# EAGLE board 16REG_2a (EAGLE 6.5.0), part 1 of 2
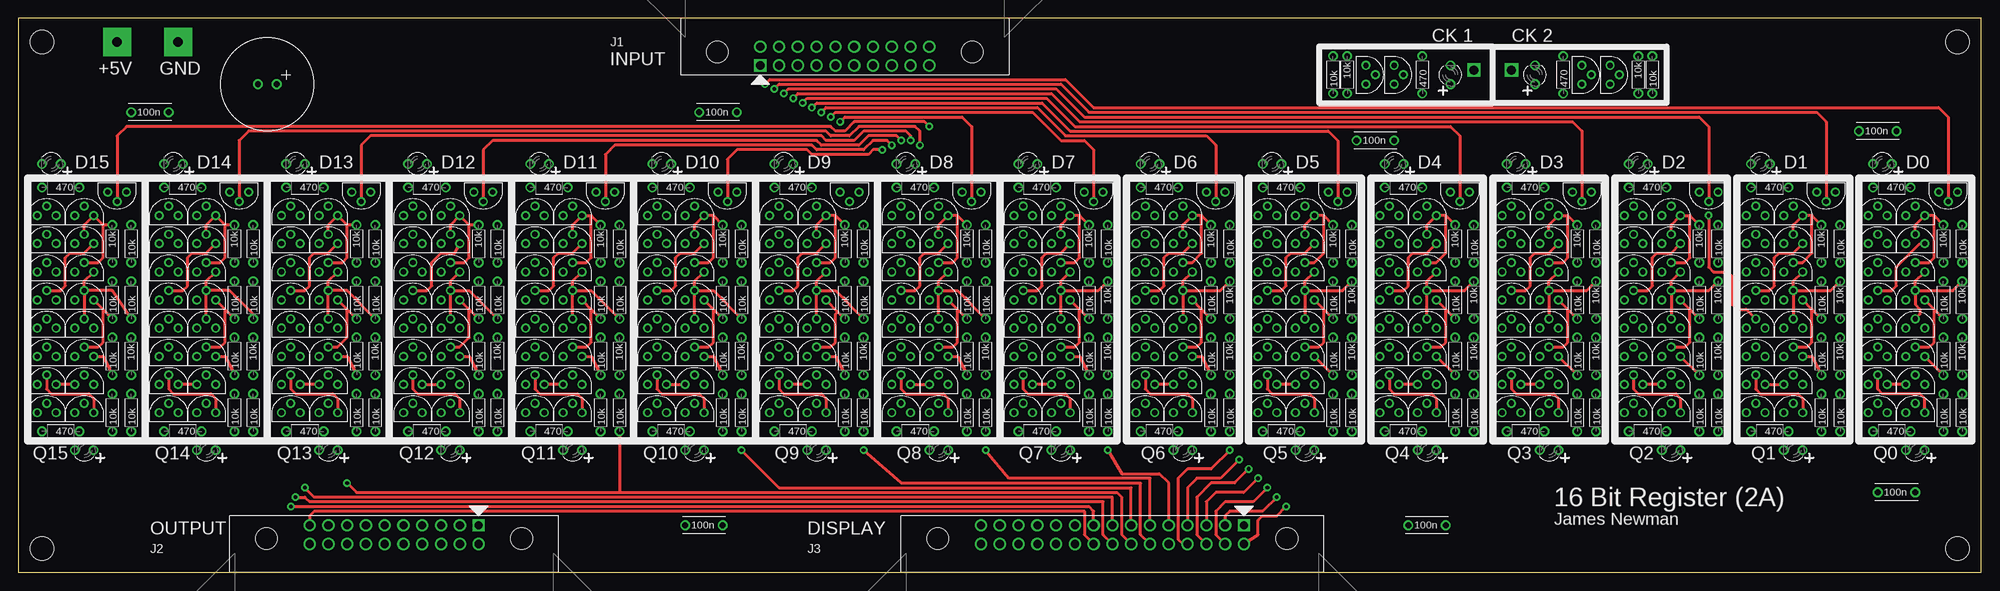
[diagram p19: board, top side]
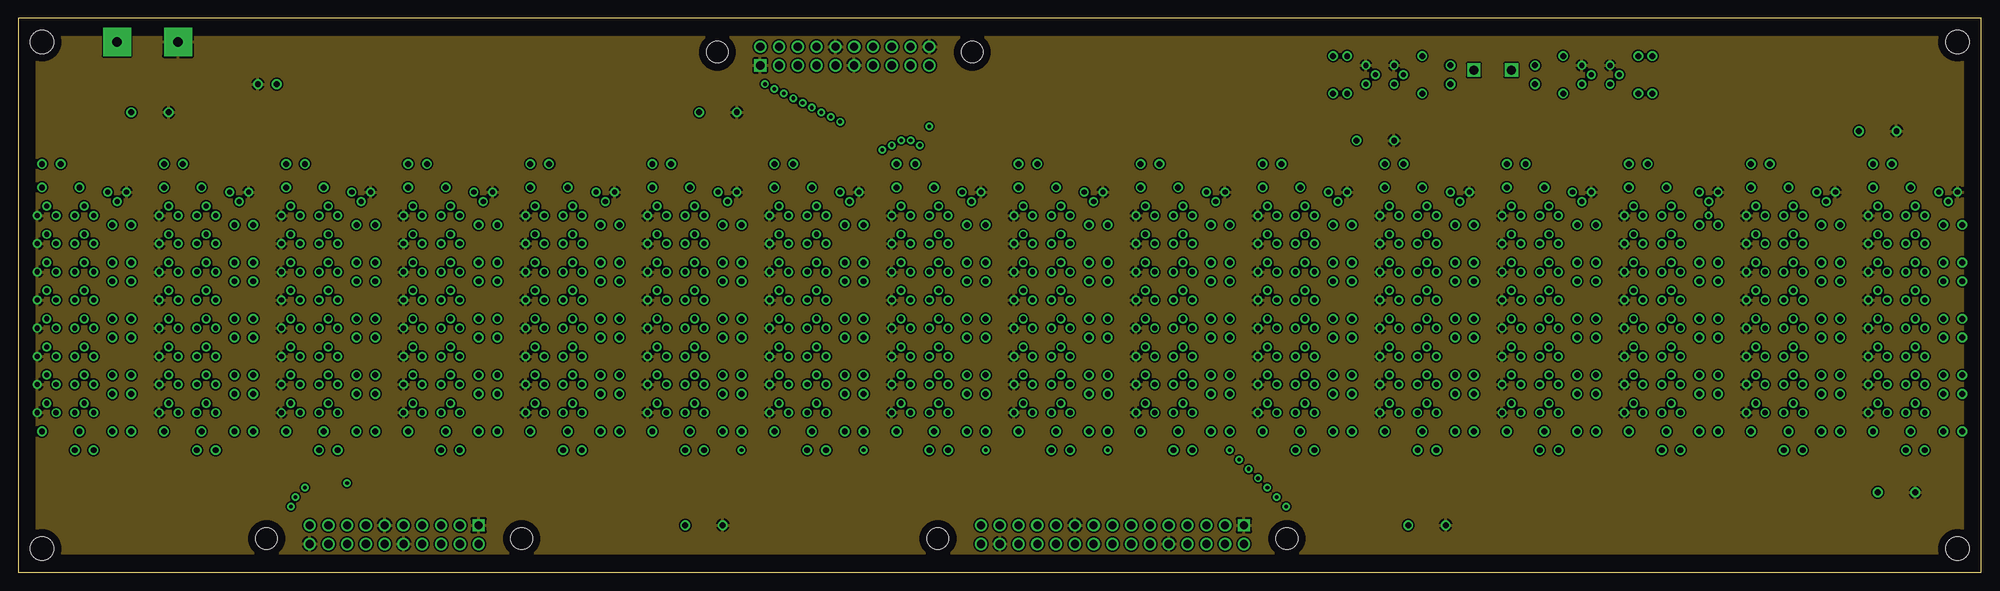
[diagram p20: board, inner layer Route2]
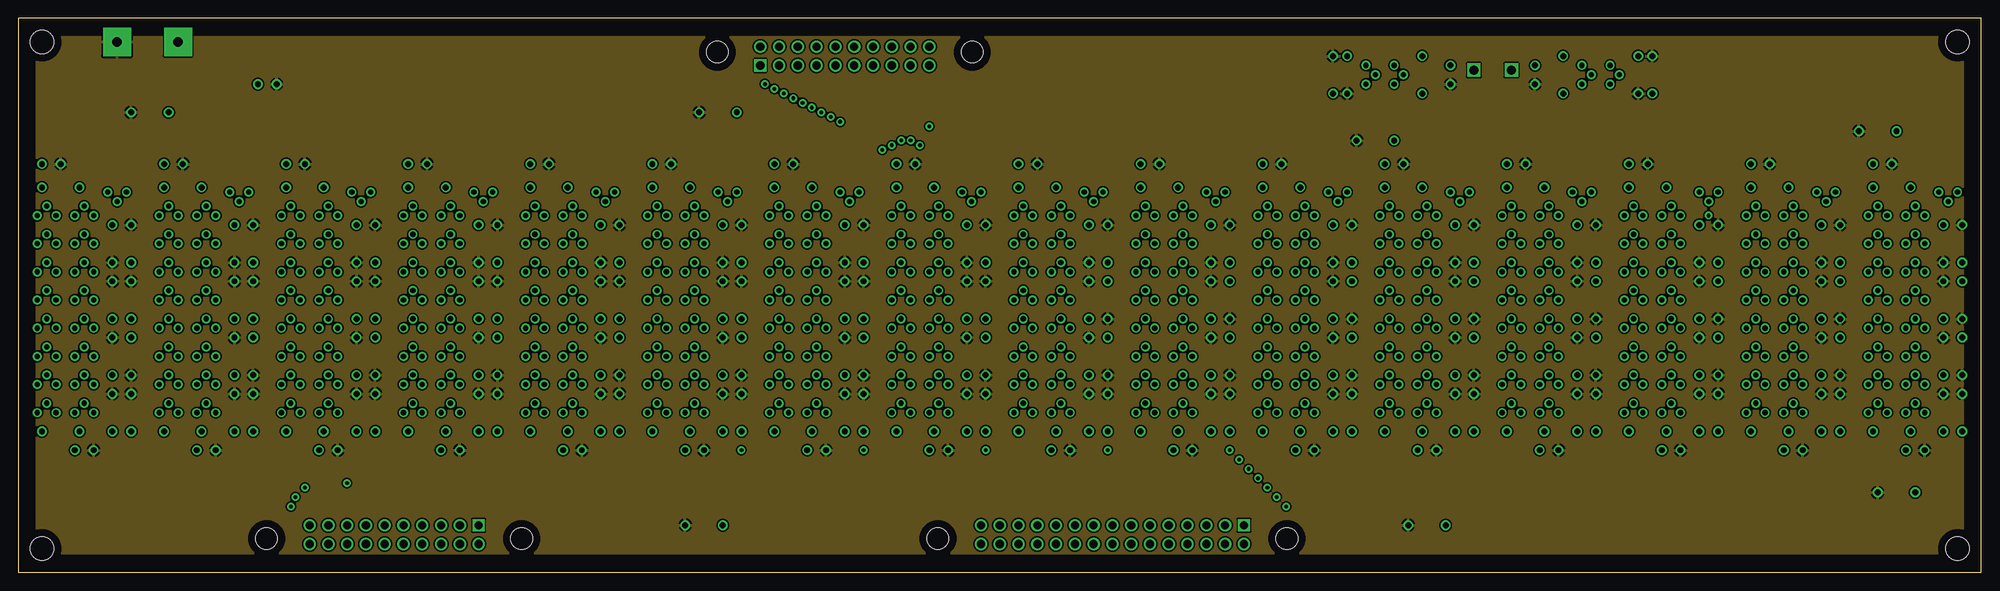
[diagram p21: board, inner layer Route3]
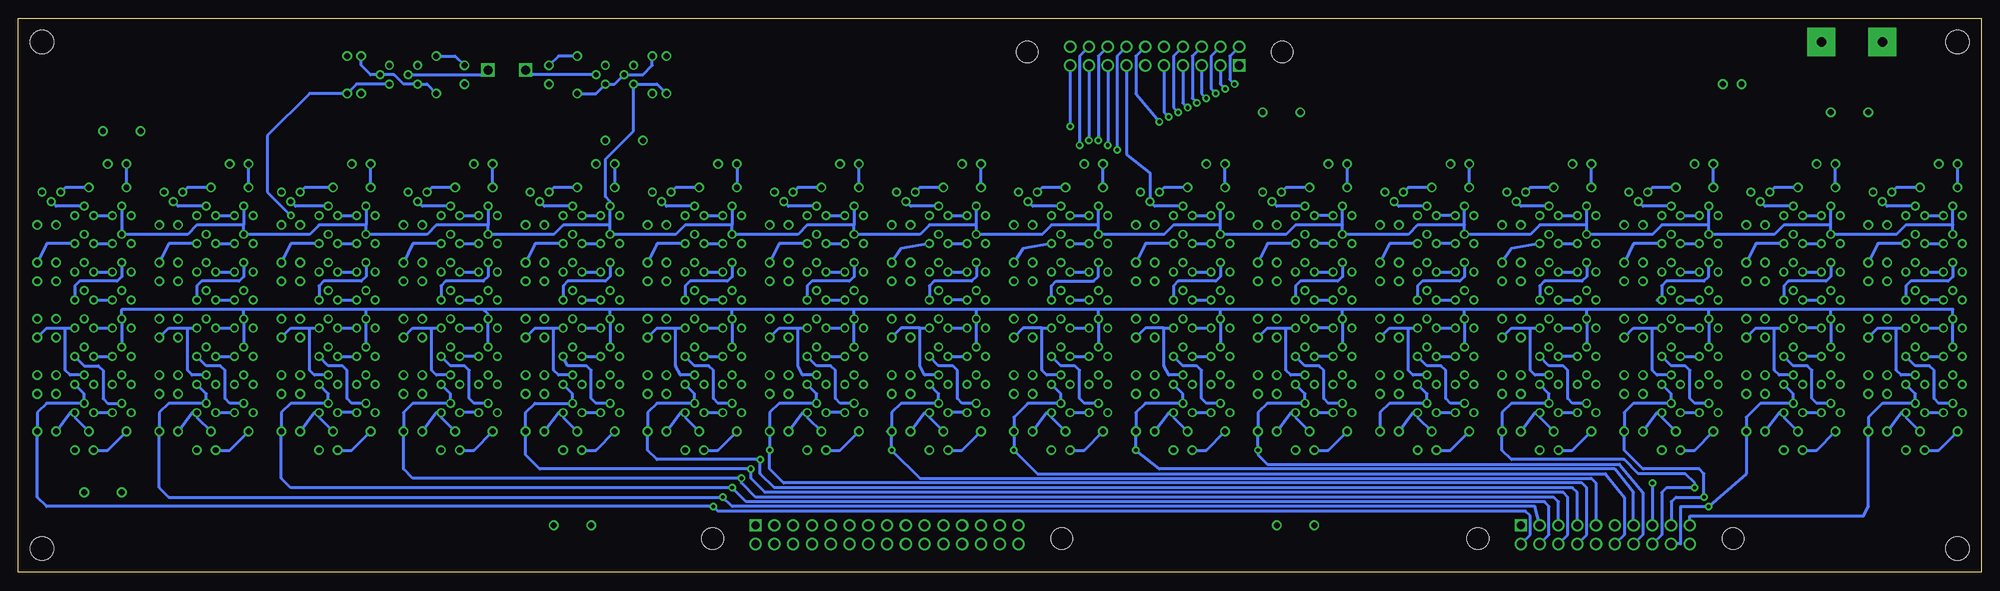
[diagram p22: board, bottom side, seen from below]

Size 265.43 x 74.93 mm. Coordinates in mm from the lower left corner, seen from the top.
Outline: 0,0 265.43,0 265.43,74.93 0,74.93 0,0
Copper layers (1*2+3*16): Top 0.035mm / dielectric 0.2mm / Route2 0.035mm / dielectric 1mm / Route3 0.035mm / dielectric 0.2mm / Bottom 0.035mm
Design rules "processor_rules_4layer": minimum track width 10mil, minimum drill 0.0236mm, track to track 8mil, track to pad 8mil, pad to pad 8mil, via to via 8mil, smd to smd 8mil, copper to edge 40mil, drill to drill 8mil, minimum pad ring 10mil, minimum via ring 8mil, stop-mask expansion 4mil, vias tented up to drill 0.7mm, thermal gap 10mil

## Footprints (pad centres in the part's own frame; a part is rotated, then mirrored left to right if it is on the bottom)
CAP_P2INCH = drill 0.8: 1 -2.54,0; 2 2.54,0
POLARISED_CAP_2P5 = drill 0.8: A 1.27,0; K -1.27,0
LED3MM = drill 0.8: A -1.27,0; K 1.27,0
3M_HOLE = hole 3.2: 0,0
20_HDR_LOCKING_RA = drill 1.1 square: 1 -11.43,-1.27 | drill 1.1: 2 -11.43,1.27; 3 -8.89,-1.27; 4 -8.89,1.27; 5 -6.35,-1.27; 6 -6.35,1.27; 7 -3.81,-1.27; 8 -3.81,1.27; 9 -1.27,-1.27; 10 -1.27,1.27; 11 1.27,-1.27; 12 1.27,1.27; 13 3.81,-1.27; 14 3.81,1.27; 15 6.35,-1.27; 16 6.35,1.27; 17 8.89,-1.27; 18 8.89,1.27; 19 11.43,-1.27; 20 11.43,1.27 | hole 2.946: -17.247,0.533; 17.247,0.533
30_HDR_LOCKING_RA = drill 1.1 square: 1 -17.78,-1.27 | drill 1.1: 2 -17.78,1.27; 3 -15.24,-1.27; 4 -15.24,1.27; 5 -12.7,-1.27; 6 -12.7,1.27; 7 -10.16,-1.27; 8 -10.16,1.27; 9 -7.62,-1.27; 10 -7.62,1.27; 11 -5.08,-1.27; 12 -5.08,1.27; 13 -2.54,-1.27; 14 -2.54,1.27; 15 0,-1.27; 16 0,1.27; 17 2.54,-1.27; 18 2.54,1.27; 19 5.08,-1.27; 20 5.08,1.27; 21 7.62,-1.27; 22 7.62,1.27; 23 10.16,-1.27; 24 10.16,1.27; 25 12.7,-1.27; 26 12.7,1.27; 27 15.24,-1.27; 28 15.24,1.27; 29 17.78,-1.27; 30 17.78,1.27 | hole 2.946: -23.597,0.533; 23.597,0.533
POWER_PAD = drill 1.3 pad 3.81 square: 1 0,0
TO92-DGS = drill 0.7: D 0,1.27; G -1.27,0; S 0,-1.27
R_P2INCH = drill 0.8: 1 -2.54,0; 2 2.54,0
TEST_LOOP = drill 1.2 square: P$1 0,0

## Placement (x,y rotation side)
C1  100n  [CAP_P2INCH]  183.51,58.42 0 top
C2  100n  [CAP_P2INCH]  17.78,62.23 0 top
C3  100n  [CAP_P2INCH]  251.46,59.69 0 top
C4  100n  [CAP_P2INCH]  254,10.79 0 top
C5  100u  [POLARISED_CAP_2P5]  33.66,66.04 0 top
C6  100n  [CAP_P2INCH]  94.61,62.23 0 top
C7  100n  [CAP_P2INCH]  92.71,6.35 0 top
C8  100n  [CAP_P2INCH]  190.5,6.35 0 top
D1  L-1334SRT  [LED3MM]  256.54,16.51 180 top
D2  L-1334SRT  [LED3MM]  240.03,16.51 180 top
D3  L-1334SRT  [LED3MM]  223.52,16.51 180 top
D4  L-1334SRT  [LED3MM]  207.01,16.51 180 top
D5  L-1334SRT  [LED3MM]  190.5,16.51 180 top
D6  L-1334SRT  [LED3MM]  173.99,16.51 180 top
D7  L-1334SRT  [LED3MM]  157.48,16.51 180 top
D8  L-1334SRT  [LED3MM]  140.97,16.51 180 top
D9  L-1334SRT  [LED3MM]  124.46,16.51 180 top
D10  L-1334SRT  [LED3MM]  107.95,16.51 180 top
D11  L-1334SRT  [LED3MM]  91.44,16.51 180 top
D12  L-1334SRT  [LED3MM]  74.93,16.51 180 top
D13  L-1334SRT  [LED3MM]  58.42,16.51 180 top
D14  L-1334SRT  [LED3MM]  41.91,16.51 180 top
D15  L-1334SRT  [LED3MM]  25.4,16.51 180 top
D16  L-1334SRT  [LED3MM]  8.89,16.51 180 top
D17  L-1334SRT  [LED3MM]  193.68,67.31 90 top
D18  L-1334SRT  [LED3MM]  252.09,55.24 180 top
D19  L-1334SRT  [LED3MM]  235.59,55.24 180 top
D20  L-1334SRT  [LED3MM]  219.07,55.24 180 top
D21  L-1334SRT  [LED3MM]  202.56,55.24 180 top
D22  L-1334SRT  [LED3MM]  186.06,55.24 180 top
D23  L-1334SRT  [LED3MM]  169.54,55.24 180 top
D24  L-1334SRT  [LED3MM]  153.03,55.24 180 top
D25  L-1334SRT  [LED3MM]  136.53,55.24 180 top
D26  L-1334SRT  [LED3MM]  120.02,55.24 180 top
D27  L-1334SRT  [LED3MM]  103.5,55.24 180 top
D28  L-1334SRT  [LED3MM]  87,55.24 180 top
D29  L-1334SRT  [LED3MM]  70.48,55.24 180 top
D30  L-1334SRT  [LED3MM]  53.98,55.24 180 top
D31  L-1334SRT  [LED3MM]  37.47,55.24 180 top
D32  L-1334SRT  [LED3MM]  20.95,55.24 180 top
D33  L-1334SRT  [LED3MM]  4.45,55.24 180 top
D34  L-1334SRT  [LED3MM]  205.1,67.31 90 top
HOLE1  3M_MOUNT_HOLE  [3M_HOLE]  262.25,3.17 180 top
HOLE2  3M_MOUNT_HOLE  [3M_HOLE]  3.17,3.17 0 top
HOLE3  3M_MOUNT_HOLE  [3M_HOLE]  3.17,71.75 180 top
HOLE4  3M_MOUNT_HOLE  [3M_HOLE]  262.25,71.75 0 top
J1  20_HDR_LOCKING_RA  [20_HDR_LOCKING_RA]  111.76,69.85 0 top
J2  20_HDR_LOCKING_RA  [20_HDR_LOCKING_RA]  50.8,5.08 180 top
J3  30_HDR_LOCKING_RA  [30_HDR_LOCKING_RA]  147.96,5.08 180 top
PP1  POWER_PAD  [POWER_PAD]  13.34,71.75 270 top
PP2  POWER_PAD  [POWER_PAD]  21.59,71.75 270 top
Q1  2N7000  [TO92-DGS]  251.46,48.26 270 top
Q2  2N7000  [TO92-DGS]  256.54,48.26 270 top
Q3  2N7000  [TO92-DGS]  251.46,44.45 270 top
Q4  2N7000  [TO92-DGS]  256.54,44.45 270 top
Q5  2N7000  [TO92-DGS]  251.46,40.64 270 top
Q6  2N7000  [TO92-DGS]  256.54,40.64 270 top
Q7  2N7000  [TO92-DGS]  251.46,33.02 270 top
Q8  2N7000  [TO92-DGS]  251.46,36.83 270 top
Q9  2N7000  [TO92-DGS]  256.54,36.83 270 top
Q10  2N7000  [TO92-DGS]  251.46,25.4 270 top
Q11  2N7000  [TO92-DGS]  256.54,25.4 270 top
Q12  2N7000  [TO92-DGS]  251.46,21.59 270 top
Q13  2N7000  [TO92-DGS]  256.54,21.59 270 top
Q14  2N7000  [TO92-DGS]  256.54,33.02 270 top
Q15  2N7000  [TO92-DGS]  251.46,29.21 270 top
Q16  2N7000  [TO92-DGS]  256.54,29.21 270 top
Q17  2N7000  [TO92-DGS]  234.95,48.26 270 top
Q18  2N7000  [TO92-DGS]  240.03,48.26 270 top
Q19  2N7000  [TO92-DGS]  234.95,44.45 270 top
Q20  2N7000  [TO92-DGS]  240.03,44.45 270 top
Q21  2N7000  [TO92-DGS]  234.95,40.64 270 top
Q22  2N7000  [TO92-DGS]  240.03,40.64 270 top
Q23  2N7000  [TO92-DGS]  234.95,36.83 270 top
Q24  2N7000  [TO92-DGS]  240.03,36.83 270 top
Q25  2N7000  [TO92-DGS]  234.95,25.4 270 top
Q26  2N7000  [TO92-DGS]  240.03,25.4 270 top
Q27  2N7000  [TO92-DGS]  234.95,21.59 270 top
Q28  2N7000  [TO92-DGS]  240.03,21.59 270 top
Q29  2N7000  [TO92-DGS]  234.95,33.02 270 top
Q30  2N7000  [TO92-DGS]  240.03,33.02 270 top
Q31  2N7000  [TO92-DGS]  234.95,29.21 270 top
Q32  2N7000  [TO92-DGS]  240.03,29.21 270 top
Q33  2N7000  [TO92-DGS]  218.44,48.26 270 top
Q34  2N7000  [TO92-DGS]  223.52,48.26 270 top
Q35  2N7000  [TO92-DGS]  218.44,44.45 270 top
Q36  2N7000  [TO92-DGS]  223.52,44.45 270 top
Q37  2N7000  [TO92-DGS]  218.44,40.64 270 top
Q38  2N7000  [TO92-DGS]  223.52,40.64 270 top
Q39  2N7000  [TO92-DGS]  218.44,36.83 270 top
Q40  2N7000  [TO92-DGS]  223.52,36.83 270 top
Q41  2N7000  [TO92-DGS]  218.44,25.4 270 top
Q42  2N7000  [TO92-DGS]  223.52,25.4 270 top
Q43  2N7000  [TO92-DGS]  218.44,21.59 270 top
Q44  2N7000  [TO92-DGS]  223.52,21.59 270 top
Q45  2N7000  [TO92-DGS]  218.44,33.02 270 top
Q46  2N7000  [TO92-DGS]  223.52,33.02 270 top
Q47  2N7000  [TO92-DGS]  218.44,29.21 270 top
Q48  2N7000  [TO92-DGS]  223.52,29.21 270 top
Q49  2N7000  [TO92-DGS]  201.93,48.26 270 top
Q50  2N7000  [TO92-DGS]  207.01,48.26 270 top
Q51  2N7000  [TO92-DGS]  201.93,44.45 270 top
Q52  2N7000  [TO92-DGS]  207.01,44.45 270 top
Q53  2N7000  [TO92-DGS]  201.93,40.64 270 top
Q54  2N7000  [TO92-DGS]  207.01,40.64 270 top
Q55  2N7000  [TO92-DGS]  201.93,36.83 270 top
Q56  2N7000  [TO92-DGS]  207.01,36.83 270 top
Q57  2N7000  [TO92-DGS]  201.93,25.4 270 top
Q58  2N7000  [TO92-DGS]  207.01,25.4 270 top
Q59  2N7000  [TO92-DGS]  201.93,21.59 270 top
Q60  2N7000  [TO92-DGS]  207.01,21.59 270 top
Q61  2N7000  [TO92-DGS]  201.93,33.02 270 top
Q62  2N7000  [TO92-DGS]  207.01,33.02 270 top
Q63  2N7000  [TO92-DGS]  201.93,29.21 270 top
Q64  2N7000  [TO92-DGS]  207.01,29.21 270 top
Q65  2N7000  [TO92-DGS]  185.42,48.26 270 top
Q66  2N7000  [TO92-DGS]  190.5,48.26 270 top
Q67  2N7000  [TO92-DGS]  185.42,44.45 270 top
Q68  2N7000  [TO92-DGS]  190.5,44.45 270 top
Q69  2N7000  [TO92-DGS]  185.42,40.64 270 top
Q70  2N7000  [TO92-DGS]  190.5,40.64 270 top
Q71  2N7000  [TO92-DGS]  185.42,36.83 270 top
Q72  2N7000  [TO92-DGS]  190.5,36.83 270 top
Q73  2N7000  [TO92-DGS]  185.42,25.4 270 top
Q74  2N7000  [TO92-DGS]  190.5,25.4 270 top
Q75  2N7000  [TO92-DGS]  185.42,21.59 270 top
Q76  2N7000  [TO92-DGS]  190.5,21.59 270 top
Q77  2N7000  [TO92-DGS]  185.42,33.02 270 top
Q78  2N7000  [TO92-DGS]  190.5,33.02 270 top
Q79  2N7000  [TO92-DGS]  185.42,29.21 270 top
Q80  2N7000  [TO92-DGS]  190.5,29.21 270 top
Q81  2N7000  [TO92-DGS]  168.91,48.26 270 top
Q82  2N7000  [TO92-DGS]  173.99,48.26 270 top
Q83  2N7000  [TO92-DGS]  168.91,44.45 270 top
Q84  2N7000  [TO92-DGS]  173.99,44.45 270 top
Q85  2N7000  [TO92-DGS]  168.91,40.64 270 top
Q86  2N7000  [TO92-DGS]  173.99,40.64 270 top
Q87  2N7000  [TO92-DGS]  168.91,36.83 270 top
Q88  2N7000  [TO92-DGS]  173.99,36.83 270 top
Q89  2N7000  [TO92-DGS]  168.91,25.4 270 top
Q90  2N7000  [TO92-DGS]  173.99,25.4 270 top
Q91  2N7000  [TO92-DGS]  168.91,21.59 270 top
Q92  2N7000  [TO92-DGS]  173.99,21.59 270 top
Q93  2N7000  [TO92-DGS]  168.91,33.02 270 top
Q94  2N7000  [TO92-DGS]  173.99,33.02 270 top
Q95  2N7000  [TO92-DGS]  168.91,29.21 270 top
Q96  2N7000  [TO92-DGS]  173.99,29.21 270 top
Q97  2N7000  [TO92-DGS]  152.4,48.26 270 top
Q98  2N7000  [TO92-DGS]  157.48,48.26 270 top
Q99  2N7000  [TO92-DGS]  152.4,44.45 270 top
Q100  2N7000  [TO92-DGS]  157.48,44.45 270 top
Q101  2N7000  [TO92-DGS]  152.4,40.64 270 top
Q102  2N7000  [TO92-DGS]  157.48,40.64 270 top
Q103  2N7000  [TO92-DGS]  152.4,36.83 270 top
Q104  2N7000  [TO92-DGS]  157.48,36.83 270 top
Q105  2N7000  [TO92-DGS]  152.4,25.4 270 top
Q106  2N7000  [TO92-DGS]  157.48,25.4 270 top
Q107  2N7000  [TO92-DGS]  152.4,21.59 270 top
Q108  2N7000  [TO92-DGS]  157.48,21.59 270 top
Q109  2N7000  [TO92-DGS]  152.4,33.02 270 top
Q110  2N7000  [TO92-DGS]  157.48,33.02 270 top
Q111  2N7000  [TO92-DGS]  152.4,29.21 270 top
Q112  2N7000  [TO92-DGS]  157.48,29.21 270 top
Q113  2N7000  [TO92-DGS]  135.89,48.26 270 top
Q114  2N7000  [TO92-DGS]  140.97,48.26 270 top
Q115  2N7000  [TO92-DGS]  135.89,44.45 270 top
Q116  2N7000  [TO92-DGS]  140.97,44.45 270 top
Q117  2N7000  [TO92-DGS]  135.89,40.64 270 top
Q118  2N7000  [TO92-DGS]  140.97,40.64 270 top
Q119  2N7000  [TO92-DGS]  135.89,36.83 270 top
Q120  2N7000  [TO92-DGS]  140.97,36.83 270 top
Q121  2N7000  [TO92-DGS]  135.89,25.4 270 top
Q122  2N7000  [TO92-DGS]  140.97,25.4 270 top
Q123  2N7000  [TO92-DGS]  135.89,21.59 270 top
Q124  2N7000  [TO92-DGS]  140.97,21.59 270 top
Q125  2N7000  [TO92-DGS]  135.89,33.02 270 top
Q126  2N7000  [TO92-DGS]  140.97,33.02 270 top
Q127  2N7000  [TO92-DGS]  135.89,29.21 270 top
Q128  2N7000  [TO92-DGS]  140.97,29.21 270 top
Q129  2N7000  [TO92-DGS]  119.38,48.26 270 top
Q130  2N7000  [TO92-DGS]  124.46,48.26 270 top
Q131  2N7000  [TO92-DGS]  119.38,44.45 270 top
Q132  2N7000  [TO92-DGS]  124.46,44.45 270 top
Q133  2N7000  [TO92-DGS]  119.38,40.64 270 top
Q134  2N7000  [TO92-DGS]  124.46,40.64 270 top
Q135  2N7000  [TO92-DGS]  119.38,36.83 270 top
Q136  2N7000  [TO92-DGS]  124.46,36.83 270 top
Q137  2N7000  [TO92-DGS]  119.38,25.4 270 top
Q138  2N7000  [TO92-DGS]  124.46,25.4 270 top
Q139  2N7000  [TO92-DGS]  119.38,21.59 270 top
Q140  2N7000  [TO92-DGS]  124.46,21.59 270 top
Q141  2N7000  [TO92-DGS]  119.38,33.02 270 top
Q142  2N7000  [TO92-DGS]  124.46,33.02 270 top
Q143  2N7000  [TO92-DGS]  119.38,29.21 270 top
Q144  2N7000  [TO92-DGS]  124.46,29.21 270 top
Q145  2N7000  [TO92-DGS]  102.87,48.26 270 top
Q146  2N7000  [TO92-DGS]  107.95,48.26 270 top
Q147  2N7000  [TO92-DGS]  102.87,44.45 270 top
Q148  2N7000  [TO92-DGS]  107.95,44.45 270 top
Q149  2N7000  [TO92-DGS]  102.87,40.64 270 top
Q150  2N7000  [TO92-DGS]  107.95,40.64 270 top
Q151  2N7000  [TO92-DGS]  102.87,36.83 270 top
Q152  2N7000  [TO92-DGS]  107.95,36.83 270 top
Q153  2N7000  [TO92-DGS]  102.87,25.4 270 top
Q154  2N7000  [TO92-DGS]  107.95,25.4 270 top
Q155  2N7000  [TO92-DGS]  102.87,21.59 270 top
Q156  2N7000  [TO92-DGS]  107.95,21.59 270 top
Q157  2N7000  [TO92-DGS]  102.87,33.02 270 top
Q158  2N7000  [TO92-DGS]  107.95,33.02 270 top
Q159  2N7000  [TO92-DGS]  102.87,29.21 270 top
Q160  2N7000  [TO92-DGS]  107.95,29.21 270 top
Q161  2N7000  [TO92-DGS]  86.36,48.26 270 top
Q162  2N7000  [TO92-DGS]  91.44,48.26 270 top
Q163  2N7000  [TO92-DGS]  86.36,44.45 270 top
Q164  2N7000  [TO92-DGS]  91.44,44.45 270 top
Q165  2N7000  [TO92-DGS]  86.36,40.64 270 top
Q166  2N7000  [TO92-DGS]  91.44,40.64 270 top
Q167  2N7000  [TO92-DGS]  86.36,36.83 270 top
Q168  2N7000  [TO92-DGS]  91.44,36.83 270 top
Q169  2N7000  [TO92-DGS]  86.36,25.4 270 top
Q170  2N7000  [TO92-DGS]  91.44,25.4 270 top
Q171  2N7000  [TO92-DGS]  86.36,21.59 270 top
Q172  2N7000  [TO92-DGS]  91.44,21.59 270 top
Q173  2N7000  [TO92-DGS]  86.36,33.02 270 top
Q174  2N7000  [TO92-DGS]  91.44,33.02 270 top
Q175  2N7000  [TO92-DGS]  86.36,29.21 270 top
Q176  2N7000  [TO92-DGS]  91.44,29.21 270 top
Q177  2N7000  [TO92-DGS]  69.85,48.26 270 top
Q178  2N7000  [TO92-DGS]  74.93,48.26 270 top
Q179  2N7000  [TO92-DGS]  69.85,44.45 270 top
Q180  2N7000  [TO92-DGS]  74.93,44.45 270 top
Q181  2N7000  [TO92-DGS]  69.85,40.64 270 top
Q182  2N7000  [TO92-DGS]  74.93,40.64 270 top
Q183  2N7000  [TO92-DGS]  69.85,36.83 270 top
Q184  2N7000  [TO92-DGS]  74.93,36.83 270 top
Q185  2N7000  [TO92-DGS]  69.85,25.4 270 top
Q186  2N7000  [TO92-DGS]  74.93,25.4 270 top
Q187  2N7000  [TO92-DGS]  69.85,21.59 270 top
Q188  2N7000  [TO92-DGS]  74.93,21.59 270 top
Q189  2N7000  [TO92-DGS]  69.85,33.02 270 top
Q190  2N7000  [TO92-DGS]  74.93,33.02 270 top
Q191  2N7000  [TO92-DGS]  69.85,29.21 270 top
Q192  2N7000  [TO92-DGS]  74.93,29.21 270 top
Q193  2N7000  [TO92-DGS]  53.34,48.26 270 top
Q194  2N7000  [TO92-DGS]  58.42,48.26 270 top
Q195  2N7000  [TO92-DGS]  53.34,44.45 270 top
Q196  2N7000  [TO92-DGS]  58.42,44.45 270 top
Q197  2N7000  [TO92-DGS]  53.34,40.64 270 top
Q198  2N7000  [TO92-DGS]  58.42,40.64 270 top
Q199  2N7000  [TO92-DGS]  53.34,36.83 270 top
Q200  2N7000  [TO92-DGS]  58.42,36.83 270 top
Q201  2N7000  [TO92-DGS]  53.34,25.4 270 top
Q202  2N7000  [TO92-DGS]  58.42,25.4 270 top
Q203  2N7000  [TO92-DGS]  53.34,21.59 270 top
Q204  2N7000  [TO92-DGS]  58.42,21.59 270 top
Q205  2N7000  [TO92-DGS]  53.34,33.02 270 top
Q206  2N7000  [TO92-DGS]  58.42,33.02 270 top
Q207  2N7000  [TO92-DGS]  53.34,29.21 270 top
Q208  2N7000  [TO92-DGS]  58.42,29.21 270 top
Q209  2N7000  [TO92-DGS]  186.06,67.31 180 top
Q210  2N7000  [TO92-DGS]  182.25,67.31 180 top
Q211  2N7000  [TO92-DGS]  260.99,51.44 90 top
Q212  2N7000  [TO92-DGS]  244.47,51.44 90 top
Q213  2N7000  [TO92-DGS]  228.6,51.44 90 top
Q214  2N7000  [TO92-DGS]  211.46,51.44 90 top
Q215  2N7000  [TO92-DGS]  194.94,51.44 90 top
Q216  2N7000  [TO92-DGS]  178.44,51.44 90 top
Q217  2N7000  [TO92-DGS]  161.93,51.44 90 top
Q218  2N7000  [TO92-DGS]  145.41,51.44 90 top
Q219  2N7000  [TO92-DGS]  128.91,51.44 90 top
Q220  2N7000  [TO92-DGS]  112.39,51.44 90 top
Q221  2N7000  [TO92-DGS]  95.89,51.44 90 top
Q222  2N7000  [TO92-DGS]  79.38,51.44 90 top
Q223  2N7000  [TO92-DGS]  62.87,51.44 90 top
Q224  2N7000  [TO92-DGS]  46.35,51.44 90 top
Q225  2N7000  [TO92-DGS]  29.84,51.44 90 top
Q226  2N7000  [TO92-DGS]  13.34,51.44 90 top
Q227  2N7000  [TO92-DGS]  211.46,67.31 180 top
Q228  2N7000  [TO92-DGS]  215.26,67.31 180 top
Q229  2N7000  [TO92-DGS]  36.83,48.26 270 top
Q230  2N7000  [TO92-DGS]  41.91,48.26 270 top
Q231  2N7000  [TO92-DGS]  36.83,44.45 270 top
Q232  2N7000  [TO92-DGS]  41.91,44.45 270 top
Q233  2N7000  [TO92-DGS]  36.83,40.64 270 top
Q234  2N7000  [TO92-DGS]  41.91,40.64 270 top
Q235  2N7000  [TO92-DGS]  36.83,36.83 270 top
Q236  2N7000  [TO92-DGS]  41.91,36.83 270 top
Q237  2N7000  [TO92-DGS]  36.83,25.4 270 top
Q238  2N7000  [TO92-DGS]  41.91,25.4 270 top
Q239  2N7000  [TO92-DGS]  36.83,21.59 270 top
Q240  2N7000  [TO92-DGS]  41.91,21.59 270 top
Q241  2N7000  [TO92-DGS]  36.83,33.02 270 top
Q242  2N7000  [TO92-DGS]  41.91,33.02 270 top
Q243  2N7000  [TO92-DGS]  36.83,29.21 270 top
Q244  2N7000  [TO92-DGS]  41.91,29.21 270 top
Q245  2N7000  [TO92-DGS]  20.32,48.26 270 top
Q246  2N7000  [TO92-DGS]  25.4,48.26 270 top
Q247  2N7000  [TO92-DGS]  20.32,44.45 270 top
Q248  2N7000  [TO92-DGS]  25.4,44.45 270 top
Q249  2N7000  [TO92-DGS]  20.32,40.64 270 top
Q250  2N7000  [TO92-DGS]  25.4,40.64 270 top
Q251  2N7000  [TO92-DGS]  20.32,36.83 270 top
Q252  2N7000  [TO92-DGS]  25.4,36.83 270 top
Q253  2N7000  [TO92-DGS]  20.32,25.4 270 top
Q254  2N7000  [TO92-DGS]  25.4,25.4 270 top
Q255  2N7000  [TO92-DGS]  20.32,21.59 270 top
Q256  2N7000  [TO92-DGS]  25.4,21.59 270 top
Q257  2N7000  [TO92-DGS]  20.32,33.02 270 top
Q258  2N7000  [TO92-DGS]  25.4,33.02 270 top
Q259  2N7000  [TO92-DGS]  20.32,29.21 270 top
Q260  2N7000  [TO92-DGS]  25.4,29.21 270 top
Q261  2N7000  [TO92-DGS]  3.81,48.26 270 top
Q262  2N7000  [TO92-DGS]  8.89,48.26 270 top
Q263  2N7000  [TO92-DGS]  3.81,44.45 270 top
Q264  2N7000  [TO92-DGS]  8.89,44.45 270 top
Q265  2N7000  [TO92-DGS]  3.81,40.64 270 top
Q266  2N7000  [TO92-DGS]  8.89,40.64 270 top
Q267  2N7000  [TO92-DGS]  3.81,36.83 270 top
Q268  2N7000  [TO92-DGS]  8.89,36.83 270 top
Q269  2N7000  [TO92-DGS]  3.81,25.4 270 top
Q270  2N7000  [TO92-DGS]  8.89,25.4 270 top
Q271  2N7000  [TO92-DGS]  3.81,21.59 270 top
Q272  2N7000  [TO92-DGS]  8.89,21.59 270 top
Q273  2N7000  [TO92-DGS]  3.81,33.02 270 top
Q274  2N7000  [TO92-DGS]  8.89,33.02 270 top
Q275  2N7000  [TO92-DGS]  3.81,29.21 270 top
Q276  2N7000  [TO92-DGS]  8.89,29.21 270 top
R1  10k  [R_P2INCH]  260.35,44.45 270 top
R2  10k  [R_P2INCH]  262.89,44.45 90 top
R3  10k  [R_P2INCH]  262.89,36.83 270 top
R4  10k  [R_P2INCH]  260.35,36.83 90 top
R5  10k  [R_P2INCH]  262.89,29.21 270 top
R6  10k  [R_P2INCH]  260.35,29.21 90 top
R7  470  [R_P2INCH]  253.37,19.05 180 top
R8  10k  [R_P2INCH]  262.89,21.59 90 top
R9  10k  [R_P2INCH]  260.35,21.59 90 top
R26  10k  [R_P2INCH]  243.84,44.45 270 top
R27  10k  [R_P2INCH]  246.38,44.45 90 top
R28  10k  [R_P2INCH]  246.38,36.83 270 top
R29  10k  [R_P2INCH]  243.84,36.83 90 top
R30  10k  [R_P2INCH]  246.38,29.21 270 top
R31  10k  [R_P2INCH]  243.84,29.21 90 top
R32  470  [R_P2INCH]  236.85,19.05 180 top
R33  10k  [R_P2INCH]  246.38,21.59 90 top
R34  10k  [R_P2INCH]  243.84,21.59 90 top
R35  10k  [R_P2INCH]  227.33,44.45 270 top
R36  10k  [R_P2INCH]  229.87,44.45 90 top
R37  10k  [R_P2INCH]  229.87,36.83 270 top
R38  10k  [R_P2INCH]  227.33,36.83 90 top
R39  10k  [R_P2INCH]  229.87,29.21 270 top
R40  10k  [R_P2INCH]  227.33,29.21 90 top
R41  470  [R_P2INCH]  220.34,19.05 180 top
R42  10k  [R_P2INCH]  229.87,21.59 90 top
R43  10k  [R_P2INCH]  227.33,21.59 90 top
R44  10k  [R_P2INCH]  210.82,44.45 270 top
R45  10k  [R_P2INCH]  213.36,44.45 90 top
R46  10k  [R_P2INCH]  213.36,36.83 270 top
R47  10k  [R_P2INCH]  210.82,36.83 90 top
R48  10k  [R_P2INCH]  213.36,29.21 270 top
R49  10k  [R_P2INCH]  210.82,29.21 90 top
R50  470  [R_P2INCH]  203.84,19.05 180 top
R51  10k  [R_P2INCH]  213.36,21.59 90 top
R52  10k  [R_P2INCH]  210.82,21.59 90 top
R53  10k  [R_P2INCH]  194.31,44.45 270 top
R54  10k  [R_P2INCH]  196.85,44.45 90 top
R55  10k  [R_P2INCH]  196.85,36.83 270 top
R56  10k  [R_P2INCH]  194.31,36.83 90 top
R57  10k  [R_P2INCH]  196.85,29.21 270 top
R58  10k  [R_P2INCH]  194.31,29.21 90 top
R59  470  [R_P2INCH]  187.32,19.05 180 top
R60  10k  [R_P2INCH]  196.85,21.59 90 top
R61  10k  [R_P2INCH]  194.31,21.59 90 top
R62  10k  [R_P2INCH]  177.8,44.45 270 top
R63  10k  [R_P2INCH]  180.34,44.45 90 top
R64  10k  [R_P2INCH]  180.34,36.83 270 top
R65  10k  [R_P2INCH]  177.8,36.83 90 top
R66  10k  [R_P2INCH]  180.34,29.21 270 top
R67  10k  [R_P2INCH]  177.8,29.21 90 top
R68  470  [R_P2INCH]  170.81,19.05 180 top
R69  10k  [R_P2INCH]  180.34,21.59 90 top
R70  10k  [R_P2INCH]  177.8,21.59 90 top
R71  10k  [R_P2INCH]  161.29,44.45 270 top
R72  10k  [R_P2INCH]  163.83,44.45 90 top
R73  10k  [R_P2INCH]  163.83,36.83 270 top
R74  10k  [R_P2INCH]  161.29,36.83 90 top
R75  10k  [R_P2INCH]  163.83,29.21 270 top
R76  10k  [R_P2INCH]  161.29,29.21 90 top
R77  470  [R_P2INCH]  154.31,19.05 180 top
R78  10k  [R_P2INCH]  163.83,21.59 90 top
R79  10k  [R_P2INCH]  161.29,21.59 90 top
R80  10k  [R_P2INCH]  144.78,44.45 270 top
R81  10k  [R_P2INCH]  147.32,44.45 90 top
R82  10k  [R_P2INCH]  147.32,36.83 270 top
R83  10k  [R_P2INCH]  144.78,36.83 90 top
R84  10k  [R_P2INCH]  147.32,29.21 270 top
R85  10k  [R_P2INCH]  144.78,29.21 90 top
R86  470  [R_P2INCH]  137.79,19.05 180 top
R87  10k  [R_P2INCH]  147.32,21.59 90 top
R88  10k  [R_P2INCH]  144.78,21.59 90 top
R89  10k  [R_P2INCH]  128.27,44.45 270 top
R90  10k  [R_P2INCH]  130.81,44.45 90 top
R91  10k  [R_P2INCH]  130.81,36.83 90 top
R92  10k  [R_P2INCH]  128.27,36.83 90 top
R93  10k  [R_P2INCH]  130.81,29.21 270 top
R94  10k  [R_P2INCH]  128.27,29.21 90 top
R95  470  [R_P2INCH]  121.28,19.05 180 top
R96  10k  [R_P2INCH]  130.81,21.59 90 top
R97  10k  [R_P2INCH]  128.27,21.59 90 top
R98  10k  [R_P2INCH]  111.76,44.45 270 top
R99  10k  [R_P2INCH]  114.3,44.45 90 top
R100  10k  [R_P2INCH]  114.3,36.83 90 top
R101  10k  [R_P2INCH]  111.76,36.83 90 top
R102  10k  [R_P2INCH]  114.3,29.21 270 top
R103  10k  [R_P2INCH]  111.76,29.21 90 top
R104  470  [R_P2INCH]  104.78,19.05 180 top
R105  10k  [R_P2INCH]  114.3,21.59 90 top
R106  10k  [R_P2INCH]  111.76,21.59 90 top
R107  10k  [R_P2INCH]  95.25,44.45 270 top
R108  10k  [R_P2INCH]  97.79,44.45 90 top
R109  10k  [R_P2INCH]  97.79,36.83 90 top
R110  10k  [R_P2INCH]  95.25,36.83 90 top
R111  10k  [R_P2INCH]  97.79,29.21 270 top
R112  10k  [R_P2INCH]  95.25,29.21 90 top
R113  10k  [R_P2INCH]  179.71,67.31 270 top
R114  470  [R_P2INCH]  189.87,67.31 90 top
R115  10k  [R_P2INCH]  177.8,67.31 90 top
R116  470  [R_P2INCH]  121.28,52.07 180 top
R117  470  [R_P2INCH]  253.37,52.07 180 top
R118  470  [R_P2INCH]  104.78,52.07 180 top
R119  470  [R_P2INCH]  236.85,52.07 180 top
R120  470  [R_P2INCH]  88.27,52.07 180 top
R121  470  [R_P2INCH]  220.34,52.07 180 top
R122  470  [R_P2INCH]  71.75,52.07 180 top
R123  470  [R_P2INCH]  203.84,52.07 180 top
R124  470  [R_P2INCH]  55.24,52.07 180 top
R125  470  [R_P2INCH]  187.32,52.07 180 top
R126  470  [R_P2INCH]  38.73,52.07 180 top
R127  470  [R_P2INCH]  170.81,52.07 180 top
R128  470  [R_P2INCH]  22.23,52.07 180 top
R129  470  [R_P2INCH]  154.31,52.07 180 top
R130  470  [R_P2INCH]  5.71,52.07 180 top
R131  470  [R_P2INCH]  137.79,52.07 180 top
R132  10k  [R_P2INCH]  219.07,67.31 270 top
R133  470  [R_P2INCH]  208.91,67.31 90 top
R134  10k  [R_P2INCH]  220.98,67.31 90 top
R135  470  [R_P2INCH]  88.27,19.05 180 top
R136  10k  [R_P2INCH]  97.79,21.59 90 top
R137  10k  [R_P2INCH]  95.25,21.59 90 top
R138  10k  [R_P2INCH]  78.74,44.45 270 top
R139  10k  [R_P2INCH]  81.28,44.45 90 top
R140  10k  [R_P2INCH]  81.28,36.83 90 top
R141  10k  [R_P2INCH]  78.74,36.83 90 top
R142  10k  [R_P2INCH]  81.28,29.21 270 top
R143  10k  [R_P2INCH]  78.74,29.21 90 top
R144  470  [R_P2INCH]  71.75,19.05 180 top
R145  10k  [R_P2INCH]  81.28,21.59 90 top
R146  10k  [R_P2INCH]  78.74,21.59 90 top
R147  10k  [R_P2INCH]  62.23,44.45 270 top
R148  10k  [R_P2INCH]  64.77,44.45 90 top
R149  10k  [R_P2INCH]  64.77,36.83 90 top
R150  10k  [R_P2INCH]  62.23,36.83 90 top
R151  10k  [R_P2INCH]  64.77,29.21 270 top
R152  10k  [R_P2INCH]  62.23,29.21 90 top
R153  470  [R_P2INCH]  55.24,19.05 180 top
R154  10k  [R_P2INCH]  64.77,21.59 90 top
R155  10k  [R_P2INCH]  62.23,21.59 90 top
R156  10k  [R_P2INCH]  45.72,44.45 270 top
R157  10k  [R_P2INCH]  48.26,44.45 90 top
R158  10k  [R_P2INCH]  48.26,36.83 90 top
R159  10k  [R_P2INCH]  45.72,36.83 90 top
R160  10k  [R_P2INCH]  48.26,29.21 270 top
R161  10k  [R_P2INCH]  45.72,29.21 90 top
R162  470  [R_P2INCH]  38.73,19.05 180 top
R163  10k  [R_P2INCH]  48.26,21.59 90 top
R164  10k  [R_P2INCH]  45.72,21.59 90 top
R165  10k  [R_P2INCH]  29.21,44.45 270 top
R166  10k  [R_P2INCH]  31.75,44.45 90 top
R167  10k  [R_P2INCH]  31.75,36.83 90 top
R168  10k  [R_P2INCH]  29.21,36.83 90 top
R169  10k  [R_P2INCH]  31.75,29.21 270 top
R170  10k  [R_P2INCH]  29.21,29.21 90 top
R171  470  [R_P2INCH]  22.23,19.05 180 top
R172  10k  [R_P2INCH]  31.75,21.59 90 top
R173  10k  [R_P2INCH]  29.21,21.59 90 top
R174  10k  [R_P2INCH]  12.7,44.45 270 top
R175  10k  [R_P2INCH]  15.24,44.45 90 top
R176  10k  [R_P2INCH]  15.24,36.83 90 top
R177  10k  [R_P2INCH]  12.7,36.83 90 top
R178  10k  [R_P2INCH]  15.24,29.21 270 top
R179  10k  [R_P2INCH]  12.7,29.21 90 top
R180  470  [R_P2INCH]  5.71,19.05 180 top
R181  10k  [R_P2INCH]  15.24,21.59 90 top
R182  10k  [R_P2INCH]  12.7,21.59 90 top
TP1  [TEST_LOOP]  196.85,67.94 180 top
TP2  [TEST_LOOP]  201.93,67.94 90 top